# EAGLE design FY - SUPPLY_BOARD (EAGLE 6.1)
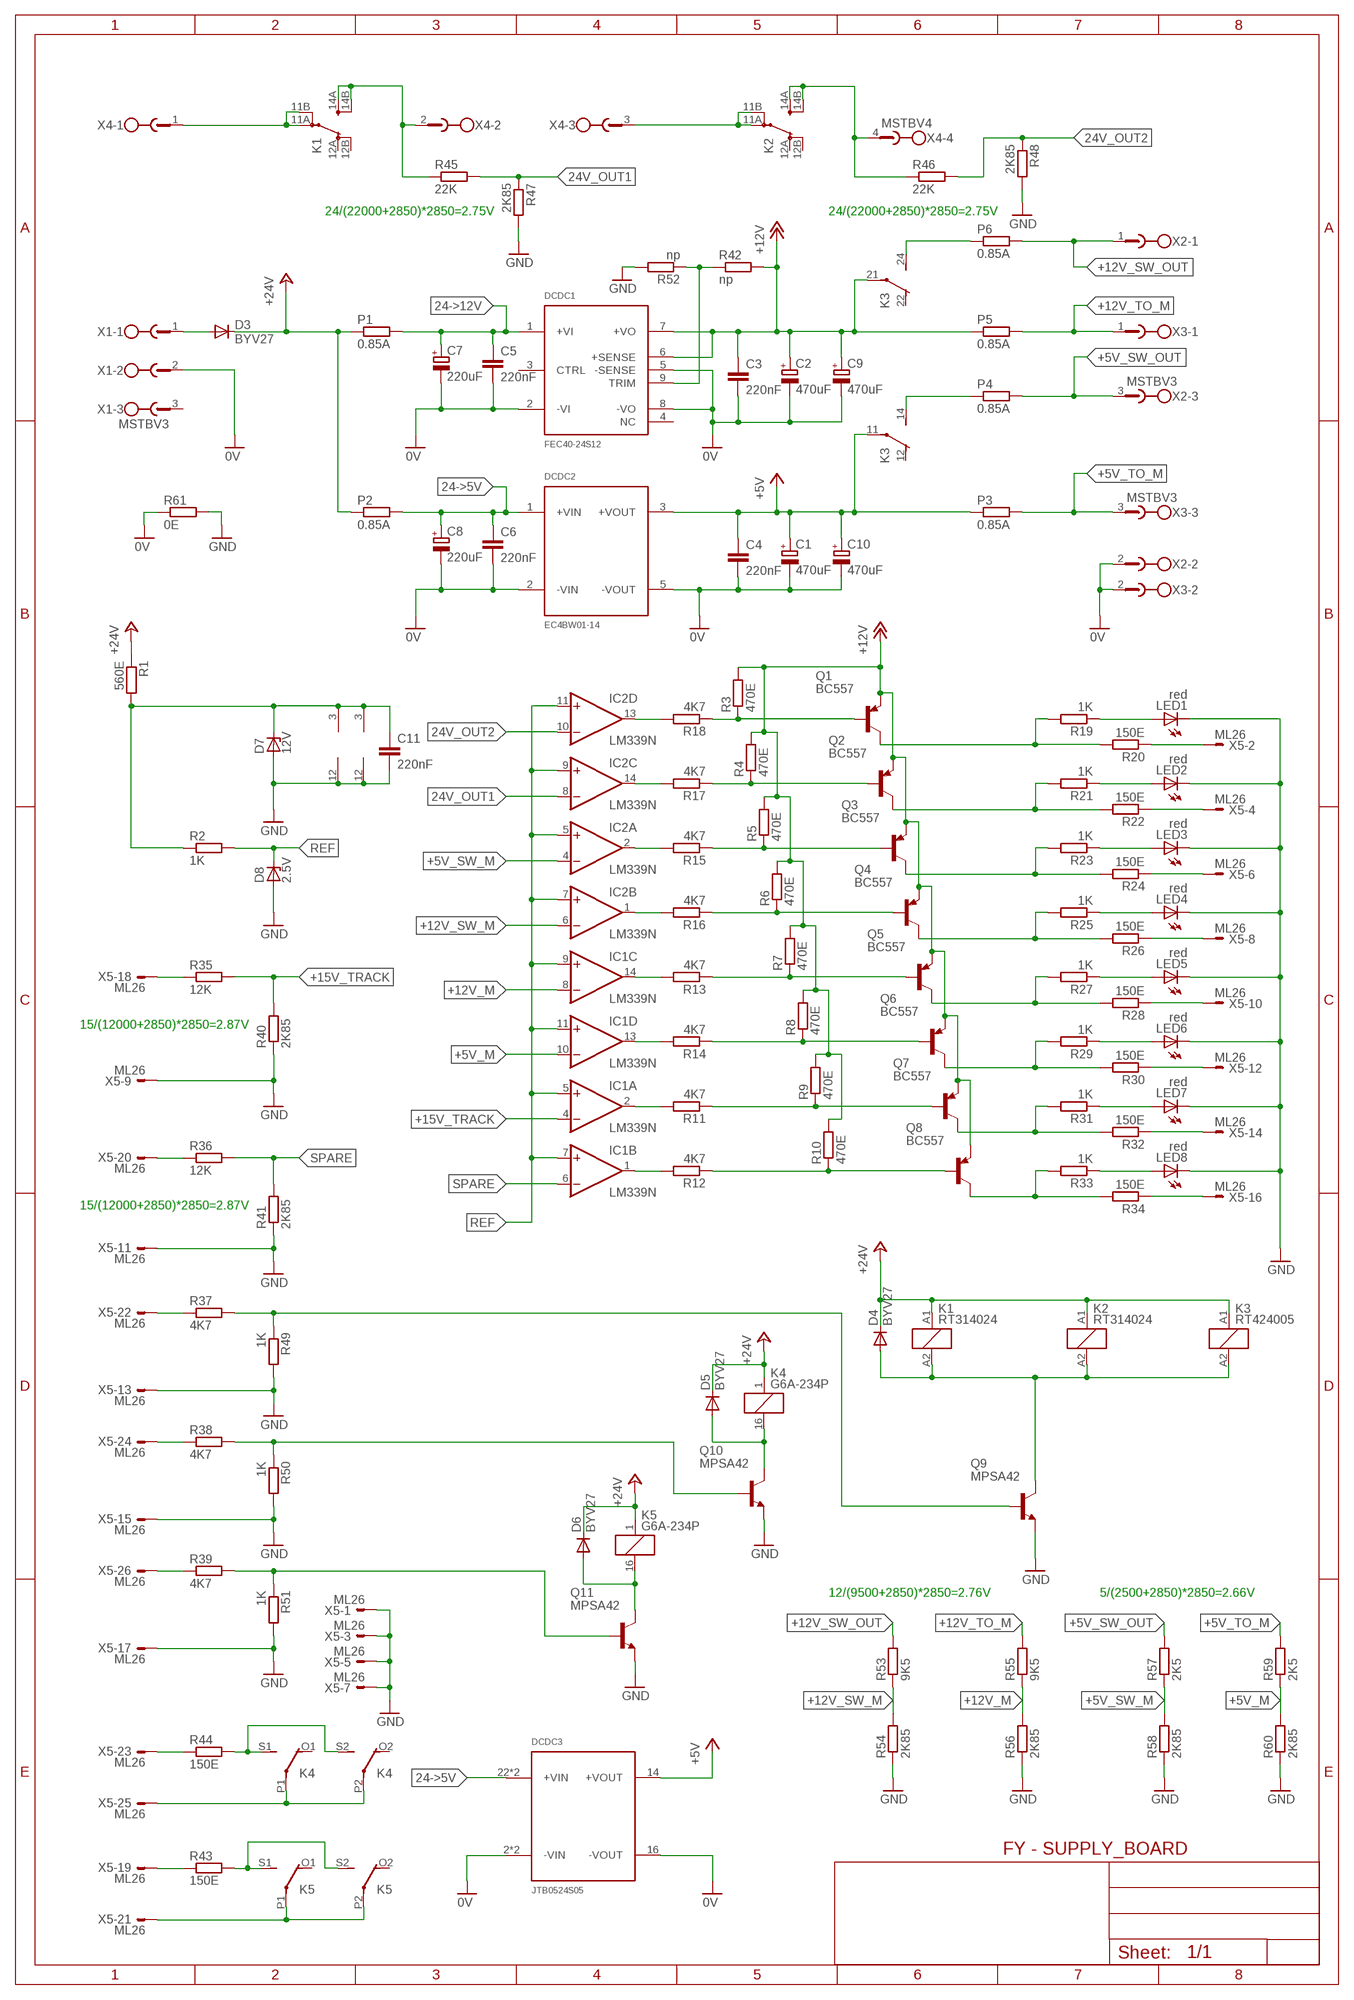
[diagram p0: schematic, sheet 1]

## Parts
C1  470uF  CPOL-EUE5-10.5  [E5-10,5]
C2  470uF  CPOL-EUE5-10.5  [E5-10,5]
C3  220nF  C-EU050-025X075  [C050-025X075]
C4  220nF  C-EU050-025X075  [C050-025X075]
C5  220nF  C-EU050-025X075  [C050-025X075]
C6  220nF  C-EU050-025X075  [C050-025X075]
C7  220uF  CPOL-EUE5-10.5  [E5-10,5]
C8  220uF  CPOL-EUE5-10.5  [E5-10,5]
C9  470uF  CPOL-EUE5-10.5  [E5-10,5]
C10  470uF  CPOL-EUE5-10.5  [E5-10,5]
C11  220nF  C-EU050-025X075  [C050-025X075]
D3  BYV27  [SOD57-10]
D4  BYV27  [SOD57-10]
D5  BYV27  [SOD57-10]
D6  BYV27  [SOD57-10]
D7  12V  ZENER-DIODEZD-7.5  [ZDIO-7.5]
D8  2.5V  ZENER-DIODEZD-7.5  [ZDIO-7.5]
DCDC1  FEC40-24S12  [FEC40-24S12]
DCDC2  EC4BW01-14  [EC4BW01-14]
DCDC3  JTB0524S05  JTB0524S05_JTB0524S05  [XP_POWER_5W]
IC1  LM339N  [DIL14]
IC2  LM339N  [DIL14]
K1  RT314024  [RT-C/O16A5]
K2  RT314024  [RT-C/O16A5]
K3  RT424005  [RT2C/O]
K4  G6A-234P  [G6A-234P]
K5  G6A-234P  [G6A-234P]
LED1  red  LED3MM  [LED3MM]
LED2  red  LED3MM  [LED3MM]
LED3  red  LED3MM  [LED3MM]
LED4  red  LED3MM  [LED3MM]
LED5  red  LED3MM  [LED3MM]
LED6  red  LED3MM  [LED3MM]
LED7  red  LED3MM  [LED3MM]
LED8  red  LED3MM  [LED3MM]
P1  0.85A  R-EU_0207/7  [0207/7]
P2  0.85A  R-EU_0207/7  [0207/7]
P3  0.85A  R-EU_0207/7  [0207/7]
P4  0.85A  R-EU_0207/7  [0207/7]
P5  0.85A  R-EU_0207/7  [0207/7]
P6  0.85A  R-EU_0207/7  [0207/7]
Q1  BC557  [TO92-EBC]
Q2  BC557  [TO92-EBC]
Q3  BC557  [TO92-EBC]
Q4  BC557  [TO92-EBC]
Q5  BC557  [TO92-EBC]
Q6  BC557  [TO92-EBC]
Q7  BC557  [TO92-EBC]
Q8  BC557  [TO92-EBC]
Q9  MPSA42  MPSA42TO92-CBE  [TO92-CBE]
Q10  MPSA42  MPSA42TO92-CBE  [TO92-CBE]
Q11  MPSA42  MPSA42TO92-CBE  [TO92-CBE]
R1  560E  R-EU_0411/15  [0411/15]
R2  1K  R-EU_0207/10  [0207/10]
R3  470E  R-EU_0207/10  [0207/10]
R4  470E  R-EU_0207/10  [0207/10]
R5  470E  R-EU_0207/10  [0207/10]
R6  470E  R-EU_0207/10  [0207/10]
R7  470E  R-EU_0207/10  [0207/10]
R8  470E  R-EU_0207/10  [0207/10]
R9  470E  R-EU_0207/10  [0207/10]
R10  470E  R-EU_0207/10  [0207/10]
R11  4K7  R-EU_0207/10  [0207/10]
R12  4K7  R-EU_0207/10  [0207/10]
R13  4K7  R-EU_0207/10  [0207/10]
R14  4K7  R-EU_0207/10  [0207/10]
R15  4K7  R-EU_0207/10  [0207/10]
R16  4K7  R-EU_0207/10  [0207/10]
R17  4K7  R-EU_0207/10  [0207/10]
R18  4K7  R-EU_0207/10  [0207/10]
R19  1K  R-EU_0207/10  [0207/10]
R20  150E  R-EU_0207/10  [0207/10]
R21  1K  R-EU_0207/10  [0207/10]
R22  150E  R-EU_0207/10  [0207/10]
R23  1K  R-EU_0207/10  [0207/10]
R24  150E  R-EU_0207/10  [0207/10]
R25  1K  R-EU_0207/10  [0207/10]
R26  150E  R-EU_0207/10  [0207/10]
R27  1K  R-EU_0207/10  [0207/10]
R28  150E  R-EU_0207/10  [0207/10]
R29  1K  R-EU_0207/10  [0207/10]
R30  150E  R-EU_0207/10  [0207/10]
R31  1K  R-EU_0207/10  [0207/10]
R32  150E  R-EU_0207/10  [0207/10]
R33  1K  R-EU_0207/10  [0207/10]
R34  150E  R-EU_0207/10  [0207/10]
R35  12K  R-EU_0207/10  [0207/10]
R36  12K  R-EU_0207/10  [0207/10]
R37  4K7  R-EU_0207/10  [0207/10]
R38  4K7  R-EU_0207/10  [0207/10]
R39  4K7  R-EU_0207/10  [0207/10]
R40  2K85  R-EU_0207/10  [0207/10]
R41  2K85  R-EU_0207/10  [0207/10]
R42  np  R-EU_0207/10  [0207/10]
R43  150E  R-EU_0922/11  [0922/11]
R44  150E  R-EU_0922/11  [0922/11]
R45  22K  R-EU_0207/10  [0207/10]
R46  22K  R-EU_0207/10  [0207/10]
R47  2K85  R-EU_0207/10  [0207/10]
R48  2K85  R-EU_0207/10  [0207/10]
R49  1K  R-EU_0207/10  [0207/10]
R50  1K  R-EU_0207/10  [0207/10]
R51  1K  R-EU_0207/10  [0207/10]
R52  np  R-EU_0207/10  [0207/10]
R53  9K5  R-EU_0207/10  [0207/10]
R54  2K85  R-EU_0207/10  [0207/10]
R55  9K5  R-EU_0207/10  [0207/10]
R56  2K85  R-EU_0207/10  [0207/10]
R57  2K5  R-EU_0207/10  [0207/10]
R58  2K85  R-EU_0207/10  [0207/10]
R59  2K5  R-EU_0207/10  [0207/10]
R60  2K85  R-EU_0207/10  [0207/10]
R61  0E  R-EU_0204/2V  [0204V]
X1  MSTBV3  [MSTBV3]
X2  MSTBV3  [MSTBV3]
X3  MSTBV3  [MSTBV3]
X4  MSTBV4  [MSTBV4]
X5  ML26  ML26E  [ML26]

## Nets
0V [RELAY_POWER_24V]: C1.- C2.- C3.2 C4.2 C5.2 C6.2 C7.- C8.- C9.- C10.- DCDC1.2(-VI) DCDC1.5(-SENSE) DCDC1.8(-VO) DCDC2.2(-VIN) DCDC2.5(-VOUT) DCDC3.2(-VIN) DCDC3.3(-VIN) DCDC3.16(-VOUT) R61.1 X1.2 X2.2 X3.2
24->5V [Power]: C6.1 C8.+ DCDC2.1(+VIN) DCDC3.22(+VIN) DCDC3.23(+VIN) P2.2
24->12V [Power]: C5.1 C7.+ DCDC1.1(+VI) P1.2
24V_OUT1: IC2.8(C:-IN) R45.2 R47.1
24V_OUT2: IC2.10(D:-IN) R46.2 R48.1
+5V [RELAY_POWER_24V]: C1.+ C4.1 C10.+ DCDC2.3(+VOUT) DCDC3.14(+VOUT) K3.11(2:P) P3.1
+5V_M: IC1.10(D:-IN) R59.1 R60.2
+5V_SW_M: IC2.4(A:-IN) R57.1 R58.2
+5V_SW_OUT [RELAY_POWER_24V]: P4.2 R57.2 X2.3
+5V_TO_M [RELAY_POWER_24V]: P3.2 R59.2 X3.3
+12V [RELAY_POWER_24V]: C2.+ C3.1 C9.+ DCDC1.6(+SENSE) DCDC1.7(+VO) K3.21(3:P) P5.1 Q1.E Q2.E Q3.E Q4.E Q5.E Q6.E Q7.E Q8.E R3.2 R4.2 R5.2 R6.2 R7.2 R8.2 R9.2 R10.2 R42.2
+12V_M: IC1.8(C:-IN) R55.1 R56.2
+12V_SW_M: IC2.6(B:-IN) R53.1 R54.2
+12V_SW_OUT [RELAY_POWER_24V]: P6.2 R53.2 X2.1
+12V_TO_M [RELAY_POWER_24V]: P5.2 R55.2 X3.1
+15V_TRACK: IC1.4(A:-IN) R35.2 R40.2
+24V [RELAY_POWER_24V]: D3.C D4.C D5.C D6.C K1.A1 K2.A1 K3.A1 K4.1 K5.1 P1.1 P2.1 R1.1
GND [Power]: C11.2 D7.A D8.A IC1.12(P:GND) IC2.12(P:GND) LED1.K(C) LED2.K(C) LED3.K(C) LED4.K(C) LED5.K(C) LED6.K(C) LED7.K(C) LED8.K(C) Q9.E Q10.E Q11.E R40.1 R41.1 R47.2 R48.2 R49.2 R50.2 R51.2 R52.2 R54.1 R56.1 R58.1 R60.1 R61.2 X5.1 X5.3 X5.5 X5.7 X5.9 X5.11 X5.13 X5.15 X5.17
N$1 [RELAY_POWER_24V]: K1.11A(2:PA) K1.11B(2:PB) X4.1
N$2: Q1.B R3.1 R18.1
N$3 [RELAY_POWER_24V]: K2.11A(2:PA) K2.11B(2:PB) X4.3
N$5: R35.1 X5.18
N$7: Q2.B R4.1 R17.1
N$8: Q3.B R5.1 R15.1
N$9 [RELAY_POWER_24V]: K3.24(3:S) P6.1
N$11: DCDC1.9(TRIM) R42.1 R52.1
N$12 [RELAY_POWER_24V]: K3.14(2:S) P4.1
N$14 [Power]: D4.A K1.A2 K2.A2 K3.A2 Q9.C
N$15: C11.1 D7.C IC1.3(P:V+) IC2.3(P:V+) R1.2 R2.1
N$16: Q4.B R6.1 R16.1
N$17: Q5.B R7.1 R13.1
N$18: Q6.B R8.1 R14.1
N$19: Q7.B R9.1 R11.1
N$20: IC1.2(A:OUT) R11.2
N$21: IC1.1(B:OUT) R12.2
N$22: IC1.14(C:OUT) R13.2
N$23: IC1.13(D:OUT) R14.2
N$24: IC2.2(A:OUT) R15.2
N$25: IC2.1(B:OUT) R16.2
N$26: Q1.C R19.2 R20.2
N$27: IC2.14(C:OUT) R17.2
N$28: IC2.13(D:OUT) R18.2
N$29: LED1.A R19.1
N$30: R20.1 X5.2
N$31: Q2.C R21.2 R22.2
N$32: R22.1 X5.4
N$33: Q3.C R23.2 R24.2
N$34: R24.1 X5.6
N$35: Q4.C R25.2 R26.2
N$36: R26.1 X5.8
N$37: Q5.C R27.2 R28.2
N$38: R28.1 X5.10
N$39: Q6.C R29.2 R30.2
N$40: R30.1 X5.12
N$41: Q7.C R31.2 R32.2
N$42: R32.1 X5.14
N$43: Q8.C R33.2 R34.2
N$44: R34.1 X5.16
N$45 [Power]: Q8.B R10.1 R12.1
N$46: LED2.A R21.1
N$47: LED3.A R23.1
N$48: LED4.A R25.1
N$49: LED5.A R27.1
N$50: LED6.A R29.1
N$51: LED7.A R31.1
N$52: LED8.A R33.1
N$53: Q9.B R37.2 R49.1
N$54: Q10.B R38.2 R50.1
N$55: R36.1 X5.20
N$56: Q11.B R39.2 R51.1
N$57: R37.1 X5.22
N$58: K5.S1(2:S) K5.S2(3:S) R43.2
N$59: R38.1 X5.24
N$60: D5.A K4.16 Q10.C
N$61 [Power]: K4.S1(2:S) K4.S2(3:S) R44.2
N$62: R39.1 X5.26
N$63: D6.A K5.16 Q11.C
N$64: R44.1 X5.23
N$65 [RELAY_POWER_24V]: D3.A X1.1
N$66: R43.1 X5.19
N$69 [Power]: K4.P1(2:P) K4.P2(3:P) X5.25
N$70 [Power]: K5.P1(2:P) K5.P2(3:P) X5.21
N$98 [RELAY_POWER_24V]: K2.14A(2:SA) K2.14B(2:SB) R46.1 X4.4
N$99 [RELAY_POWER_24V]: K1.14A(2:SA) K1.14B(2:SB) R45.1 X4.2
REF: D8.C IC1.5(A:+IN) IC1.7(B:+IN) IC1.9(C:+IN) IC1.11(D:+IN) IC2.5(A:+IN) IC2.7(B:+IN) IC2.9(C:+IN) IC2.11(D:+IN) R2.2
SPARE: IC1.6(B:-IN) R36.2 R41.2
Unconnected: DCDC1.3(CTRL) DCDC1.4(NC) K1.12A(2:OA) K1.12B(2:OB) K2.12A(2:OA) K2.12B(2:OB) K3.12(2:O) K3.22(3:O) K4.O1(2:O) K4.O2(3:O) K5.O1(2:O) K5.O2(3:O) X1.3

## Notes on the sheet
- 24/(22000+2850)*2850=2.75V | 24/(22000+2850)*2850=2.75V
- 15/(12000+2850)*2850=2.87V
- 15/(12000+2850)*2850=2.87V
- 12/(9500+2850)*2850=2.76V | 5/(2500+2850)*2850=2.66V

## Library data of the parts
C1 C2 C7-C10 = rcl:CPOL-EU: POLARIZED CAPACITOR, European symbol
C3-C6 C11 = rcl:C-EU: CAPACITOR, European symbol
D3-D6 = diode:BYV27: DIODE ultra fast
D7 D8 = diode:ZENER-DIODE: Z-Diode
DCDC1 = JSIF-DCDC:FEC40-24S12: Power Mate Technology Input 18-36V Output 12VDC 3333mA
DCDC2 = JSIF-DCDC:EC4BW01-14: CINCON EC4BW01-14 DCDC converter 10-33VDC input, 5VDC 2000mA Output
DCDC3 = JSIF-DCDC:JTB0524S05: XP Power DCDC converter JTB0524S05 Input 9-36 VDC Output 5VDC 1.0A
IC1 IC2 = linear:LM339: Low Power Low Offset Voltage Quad Comparators with open collector; LM139/LM239/LM339/LM2901/LM3302
K1 K2 = relay:RT31*: Power PCB Relayl SCHRACK 1 pole 12 / 16 A, DC- or AC-coi Source: http://www.schrack.com/.. 5819.pdf; MF: TYCO ELECTRONICS; MPN: RT314024; OC_FARNELL: 1629045; OC_NEWARK: 36K2037
K3 = relay:RT42?*: Power PCB Relay SCHRACK 2 pole 8 A, DC and AC-coil Source: http://www.schrack.com/.. 5842.pdf; MPN: RT424005; OC_FARNELL: 1629052; OC_NEWARK: 03P2425
K4 K5 = relay:G6A-234P: RELAY 2 x switch, 0.3 A/125 V AC, 1 A/30 V DC, Omron; OC_FARNELL: unknown; OC_NEWARK: unknown
LED1-LED8 = led:LED: LED OSRAM: - CHIPLED LG R971, LG N971, LY N971, LG Q971, LY Q971, LO R971, LY R971 LH N974, LH R974 LS Q976, LO Q976, LY Q976 LO Q996 - Hyper CHIPLED LW Q18S LB Q993, LB Q99A, LB R99A - SideLED LS A670, LO A670, LY A670, LG A670, LP A670 LB A673, LV A673, LT A673, LW A673 LH A674 LY A675 LS A676, LA A676, LO A676, LY A676, LW A676 LS A679, LY A679, LG A679 - Hyper Micro SIDELED® LS Y876, LA Y876, LO Y876, LY Y876 LT Y87S - SmartLED LW L88C, LW L88S LB L89C, LB L89S, LG L890 LS L89K, LO L89K, LY L89K LS L896, LA L896, LO L896, LY L896 - TOPLED LS T670, LO T670, LY T670, LG T670, LP T670 LSG T670, LSP T670, LSY T670, LOP T670, LYG T670 LG T671, LOG T671, LSG T671 LB T673, LV T673, LT T673, LW T673 LH T674 LS T676, LA T676, LO T676, LY T676, LB T676, LH T676, LSB T676, LW T676 LB T67C, LV T67C, LT T67C, LS T67K, LO T67K, LY T67K, LW E67C LS E67B, LA E67B, LO E67B, LY E67B, LB E67C, LV E67C, LT E67C LW T67C LS T679, LY T679, LG T679 LS T770, LO T770, LY T770, LG T770, LP T770 LB T773, LV T773, LT T773, LW T773 LH T774 LS E675, LA E675, LY E675, LS T675 LS T776, LA T776, LO T776, LY T776, LB T776 LHGB T686 LT T68C, LB T68C - Hyper Mini TOPLED® LB M676 - Mini TOPLED Santana® LG M470 LS M47K, LO M47K, LY M47K Source: http://www.osram.convergy.de LUXEON: - LUMILED® LXK2-PW12-R00, LXK2-PW12-S00, LXK2-PW14-U00, LXK2-PW14-V00 LXK2-PM12-R00, LXK2-PM12-S00, LXK2-PM14-U00 LXK2-PE12-Q00, LXK2-PE12-R00, LXK2-PE12-S00, LXK2-PE14-T00, LXK2-PE14-U00 LXK2-PB12-K00, LXK2-PB12-L00, LXK2-PB12-M00, LXK2-PB14-N00, LXK2-PB14-P00, LXK2-PB14-Q00 LXK2-PR12-L00, LXK2-PR12-M00, LXK2-PR14-Q00, LXK2-PR14-R00 LXK2-PD12-Q00, LXK2-PD12-R00, LXK2-PD12-S00 LXK2-PH12-R00, LXK2-PH12-S00 LXK2-PL12-P00, LXK2-PL12-Q00, LXK2-PL12-R00 Source: www.luxeon.com KINGBRIGHT: KA-3528ASYC Source: www.kingbright.com
P1-P6 R1-R42 R45-R60 = rcl:R-EU_: RESISTOR, European symbol
Q1-Q8 = transistor-pnp:BC557*: PNP Transistror
Q9-Q11 = transistor-npn:MPSA42: MPSA42 300V 500mA
R43 R44 R61 = resistor:R-EU_: RESISTOR, European symbol
X1-X3 = con-phoenix-508:MSTBV3: PHOENIX; MPN: MSTBV 2,5/3-GF-5.08; OC_FARNELL: 1792793; OC_NEWARK: 69R9846
X4 = con-phoenix-508:MSTBV4: PHOENIX; MPN: MSTBV 2,5/4-GF-5.08; OC_FARNELL: 1792794; OC_NEWARK: 69R9847
X5 = con-harting-ml:ML26?E: HARTING; OC_FARNELL: unknown; OC_NEWARK: unknown

## Net classes
0 default: width 0.305 mm, clearance 0.305 mm
1 Power: width 0.61 mm, clearance 0.305 mm
2 RELAY_POWER_24V: width 1.422 mm, clearance 0.61 mm

## Board
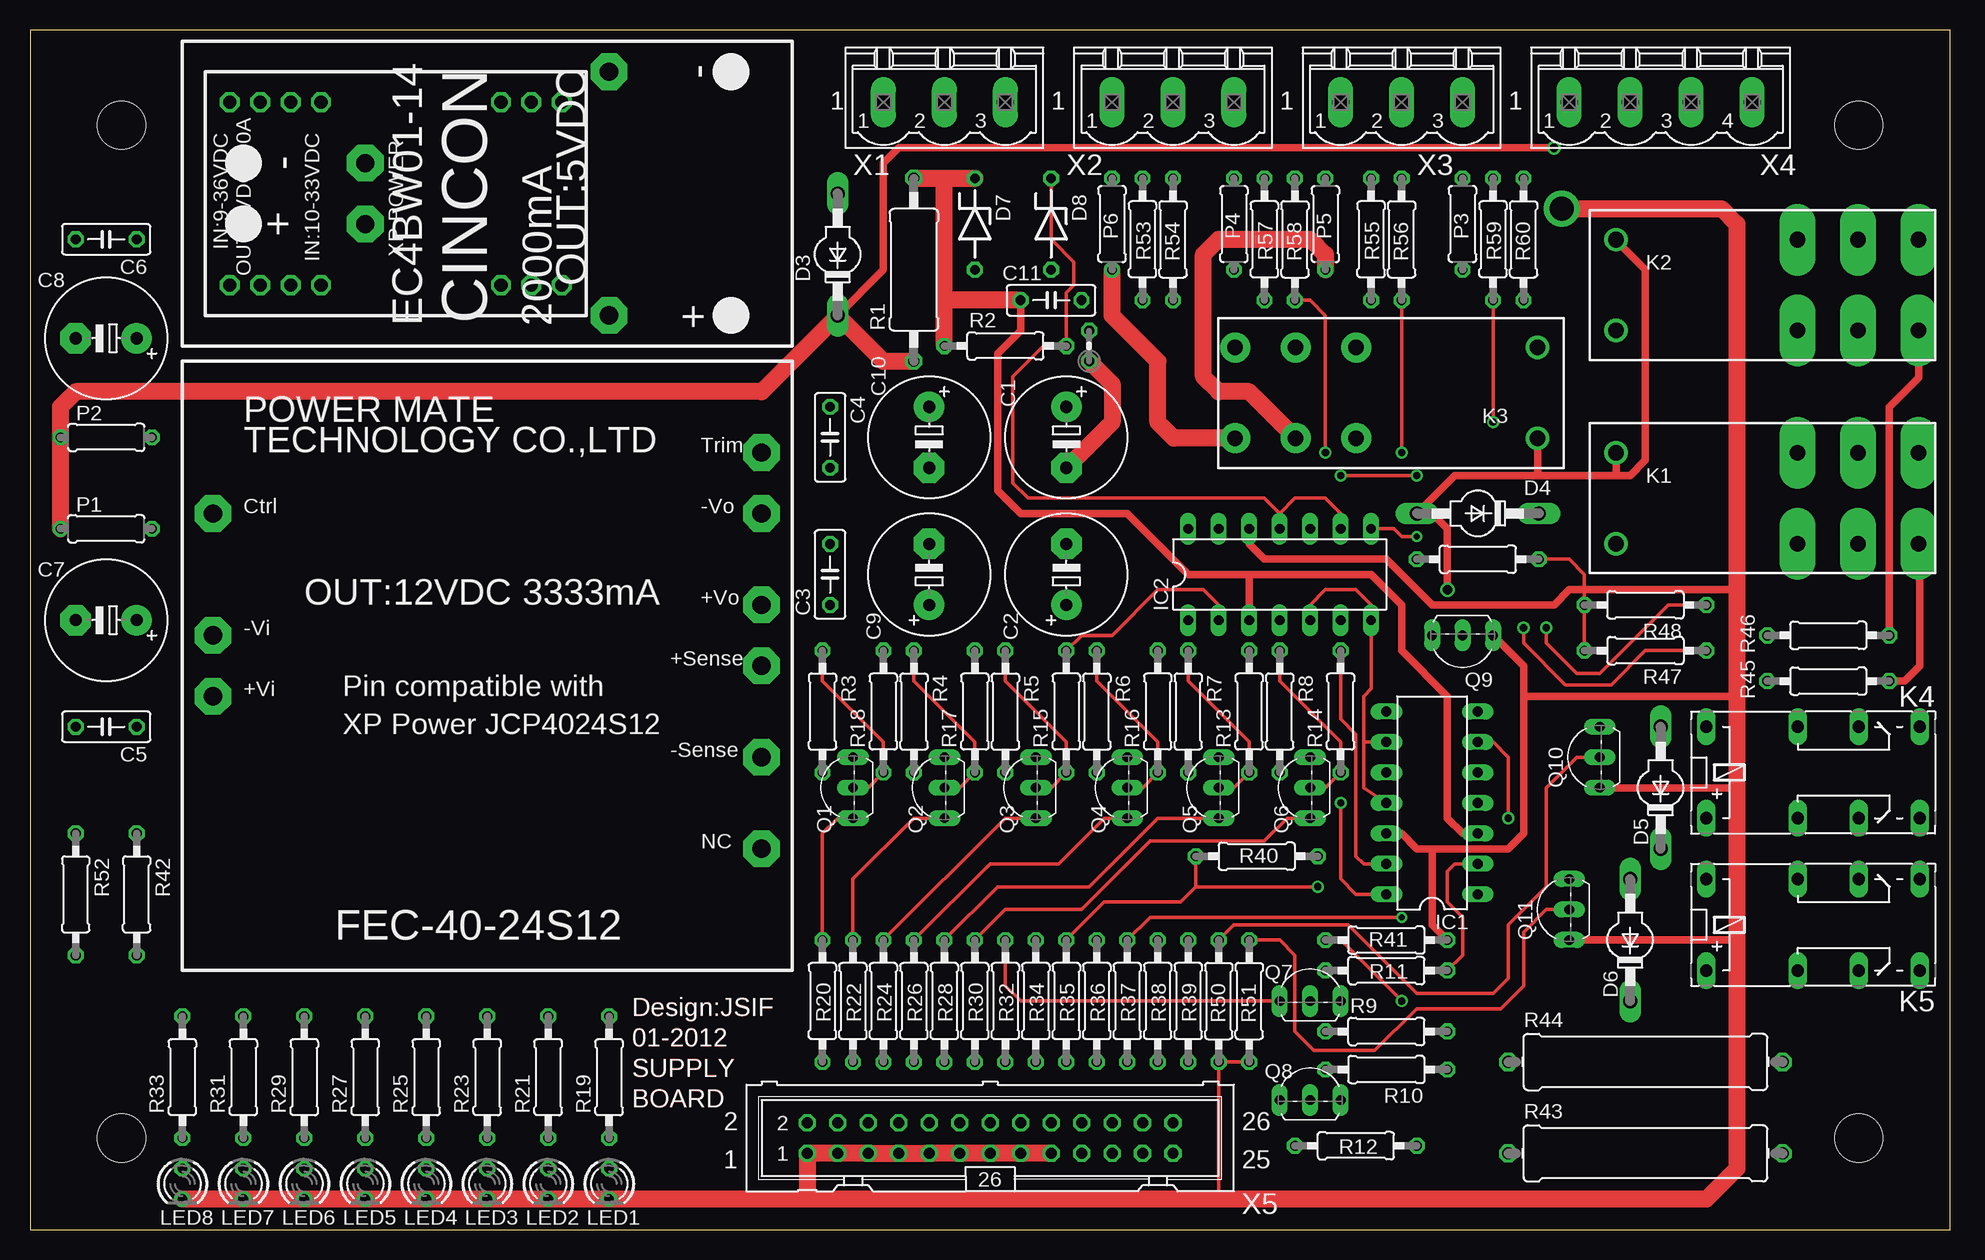
[diagram p1: board, top side]
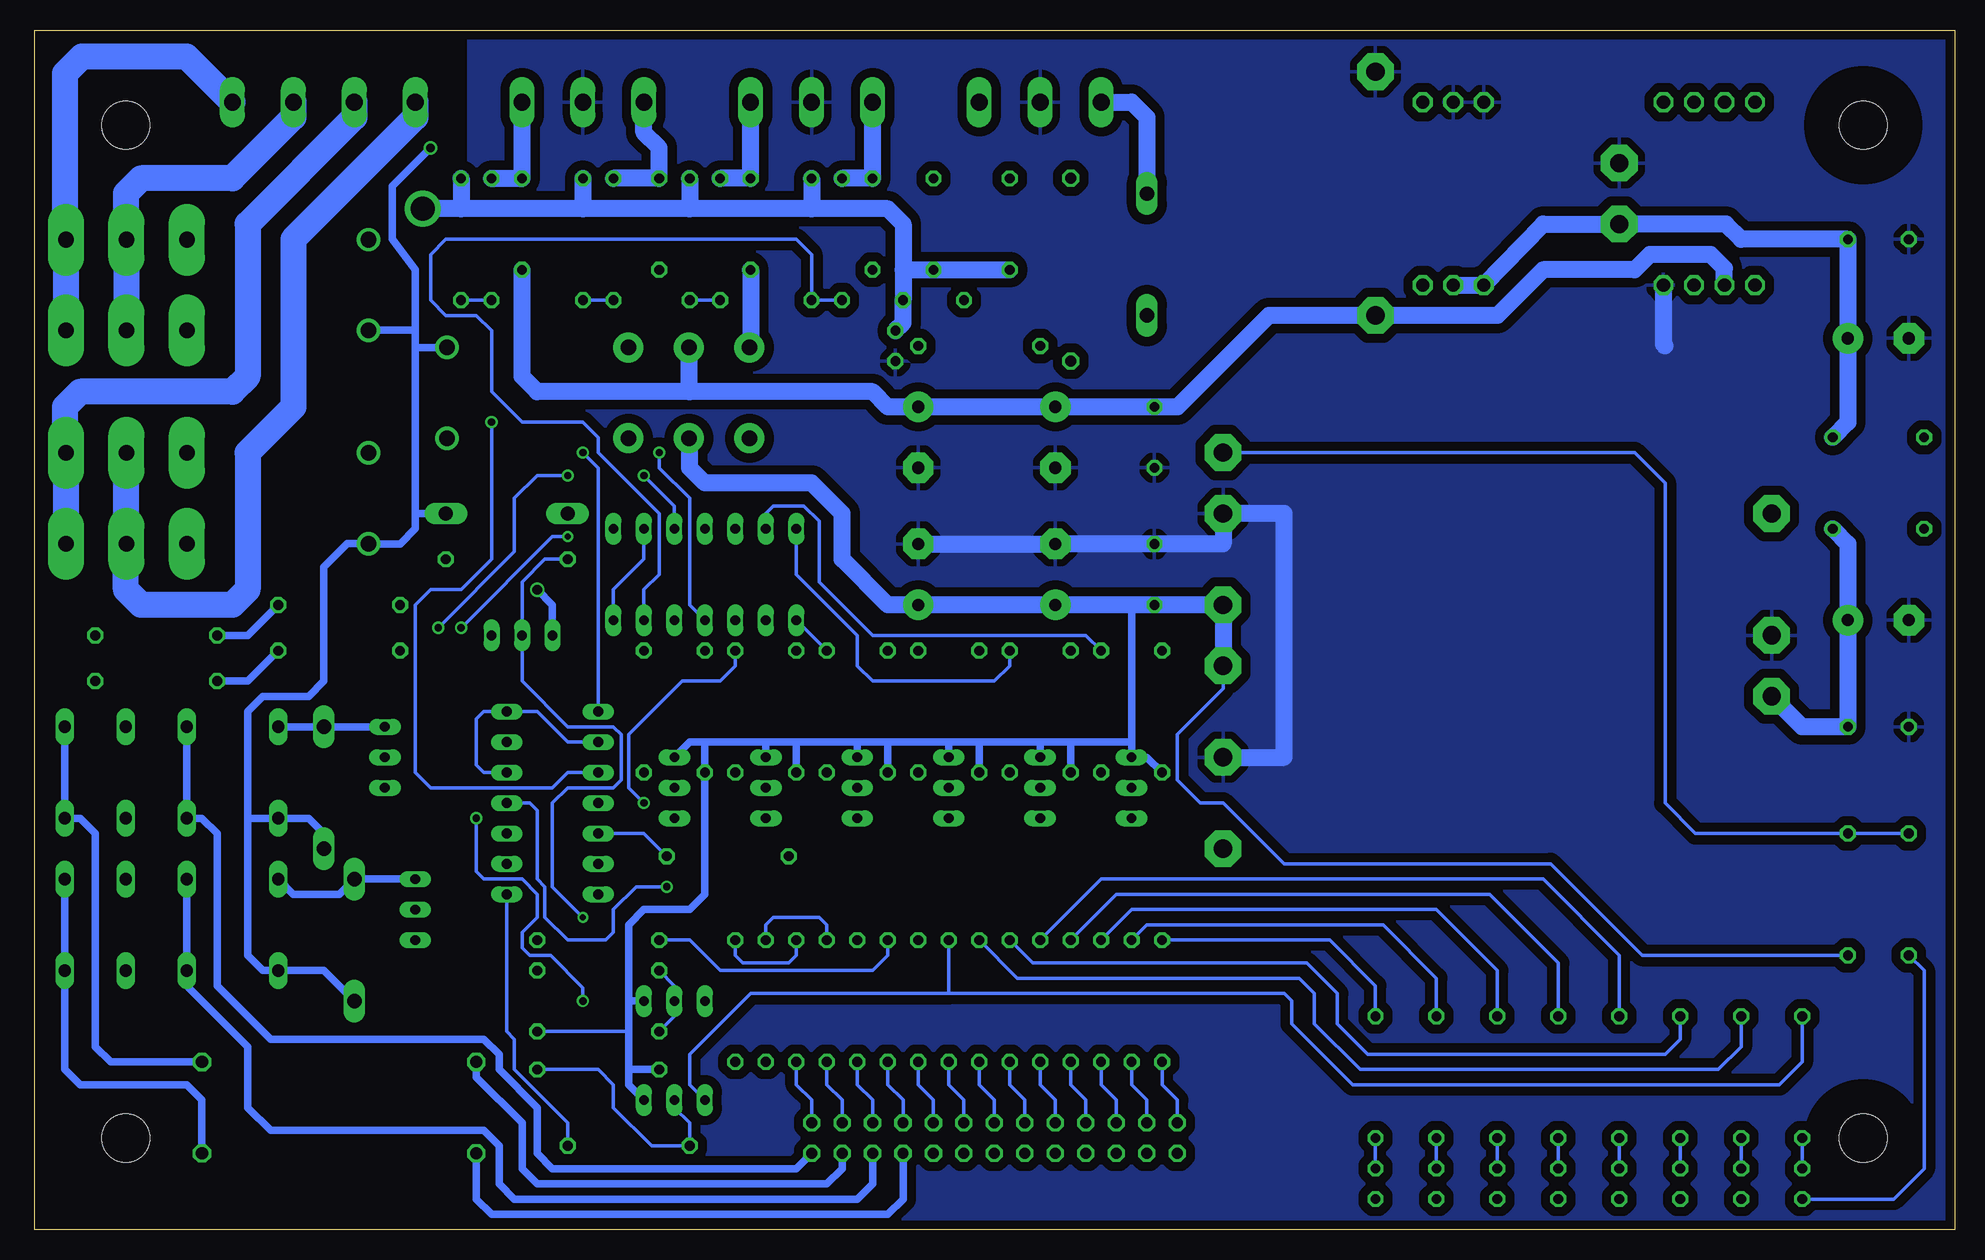
[diagram p2: board, bottom side, seen from below]

Size 160 x 100 mm. Coordinates in mm from the lower left corner, seen from the top.
Outline: 0,0 160,0 160,100 0,100 0,0
Copper layers (1*16): Top 0.035mm / dielectric 1.5mm / Bottom 0.035mm
Design rules: minimum track width 12mil, minimum drill 12mil, track to track 8mil, track to pad 8mil, pad to pad 8mil, via to via 8mil, smd to smd 8mil, copper to edge 30mil, drill to drill 8mil, minimum pad ring 10mil, minimum via ring 8mil, stop-mask expansion 4mil, vias tented up to drill 0mil, thermal gap 24mil
Holes 4 mm at 7.62,92.08 7.62,7.62 152.4,7.62 152.4,92.08
bRestrict: area 3.6,3.6 to 11.6,11.6; area 3.6,88.1 to 11.6,96.1

### Footprints (pad centres in the part's own frame; a part is rotated, then mirrored left to right if it is on the bottom)
E5-10,5 = drill 1.016 pad 2.54: + -2.54,0 | drill 1.016 pad 2.54 octagon: - 2.54,0
C050-025X075 = drill 0.813 octagon: 1 -2.54,0; 2 2.54,0
SOD57-10 = drill 1.194 long: A 5.08,0; C -5.08,0
ZDIO-7.5 = drill 0.813 octagon: A 3.81,0; C -3.81,0
FEC40-24S12 = drill 1.524 pad 3.048 octagon: 1 -22.86,-2.54; 2 -22.86,2.54; 3 -22.86,12.7; 4 22.86,-15.24; 5 22.86,-7.62; 6 22.86,0; 7 22.86,5.08; 8 22.86,12.7; 9 22.86,17.78
EC4BW01-14 = drill 1.524 pad 3.048 octagon: 1 2.54,-10.16; 2 -2.54,-10.16; 3 10.16,10.16; 5 -10.16,10.16
XP_POWER_5W = drill 1.1 octagon: 1 -7.62,13.843; 2 -7.62,11.303; 3 -7.62,8.763; 9 -7.62,-6.223; 10 -7.62,-8.763; 11 -7.62,-11.303; 12 -7.62,-13.843; 13 7.62,-13.843; 14 7.62,-11.303; 15 7.62,-8.763; 16 7.62,-6.223; 22 7.62,8.763; 23 7.62,11.303; 24 7.62,13.843
DIL14 = drill 0.813 long: 1 -7.62,-3.81; 2 -5.08,-3.81; 3 -2.54,-3.81; 4 0,-3.81; 5 2.54,-3.81; 6 5.08,-3.81; 7 7.62,-3.81; 8 7.62,3.81; 9 5.08,3.81; 10 2.54,3.81; 11 0,3.81; 12 -2.54,3.81; 13 -5.08,3.81; 14 -7.62,3.81
RT-C/O16A5 = drill 1.3 pad 3 long: 11A 7.56,3.78; 11B 7.56,-3.78; 12A 2.52,3.78; 12B 2.52,-3.78; 14A 12.6,3.78; 14B 12.6,-3.78 | drill 1.3: A1 -12.6,-3.78; A2 -12.6,3.78
RT2C/O = drill 1.3 pad 2.5: 11 7.56,-3.68; 12 2.52,-3.68; 14 12.6,-3.68; 21 7.56,3.88; 22 2.52,3.88; 24 12.6,3.88 | drill 1.3: A1 -12.6,-3.68; A2 -12.6,3.88
G6A-234P = drill 1.016 long: 1 -3.81,-3.81; 16 -3.81,3.81; O1 8.89,-3.81; O2 8.89,3.81; P1 3.81,-3.81; P2 3.81,3.81; S1 13.97,-3.81; S2 13.97,3.81
LED3MM = drill 0.813 octagon: A -1.27,0; K 1.27,0
0207/7 = drill 0.813 octagon: 1 -3.81,0; 2 3.81,0
TO92-EBC = drill 0.813 long: B 0,-1.27; C -2.54,-1.27; E 2.54,-1.27
TO92-CBE = drill 0.813 long: B 0,0; C 2.54,0; E -2.54,0
0411/15 = drill 0.914 octagon: 1 -7.62,0; 2 7.62,0
0207/10 = drill 0.813 octagon: 1 -5.08,0; 2 5.08,0
0922/11 = drill 1.016 octagon: 1 -11.43,0; 2 11.43,0
0204V = drill 0.813 octagon: 1 -1.27,0; 2 1.27,0
MSTBV3 = drill 1.397 long: 1 -5.08,0; 2 0,0; 3 5.08,0
MSTBV4 = drill 1.397 long: 1 -7.62,0; 2 -2.54,0; 3 2.54,0; 4 7.62,0
ML26 = drill 0.914 octagon: 1 -15.24,-1.27; 2 -15.24,1.27; 3 -12.7,-1.27; 4 -12.7,1.27; 5 -10.16,-1.27; 6 -10.16,1.27; 7 -7.62,-1.27; 8 -7.62,1.27; 9 -5.08,-1.27; 10 -5.08,1.27; 11 -2.54,-1.27; 12 -2.54,1.27; 13 0,-1.27; 14 0,1.27; 15 2.54,-1.27; 16 2.54,1.27; 17 5.08,-1.27; 18 5.08,1.27; 19 7.62,-1.27; 20 7.62,1.27; 21 10.16,-1.27; 22 10.16,1.27; 23 12.7,-1.27; 24 12.7,1.27; 25 15.24,-1.27; 26 15.24,1.27

### Placement (x,y rotation side)
C1  86.36,66.04 270 top
C2  86.36,54.61 90 top
C3  66.67,54.61 90 top
C4  66.67,66.04 270 top
C5  6.35,41.91 180 top
C6  6.35,82.55 180 top
C7  6.35,50.8 180 top
C8  6.35,74.3 180 top
C9  74.93,54.61 90 top
C10  74.93,66.04 270 top
C11  85.09,77.47 0 top
D3  67.31,81.28 90 top
D4  120.65,59.69 180 top
D5  135.89,36.83 90 top
D6  133.35,24.13 90 top
D7  78.74,83.82 270 top
D8  85.09,83.82 270 top
DCDC1  38.1,46.99 0 top
DCDC2  38.1,86.36 270 top
DCDC3  30.48,86.36 270 top
IC1  116.84,35.56 90 top
IC2  104.14,54.61 0 top
K1  144.78,60.96 0 top
K2  144.78,78.74 0 top
K3  113.03,69.85 180 top
K4  143.51,38.1 0 top
K5  143.51,25.4 0 top
LED1  48.26,3.81 270 top
LED2  43.18,3.81 270 top
LED3  38.1,3.81 270 top
LED4  33.02,3.81 270 top
LED5  27.94,3.81 270 top
LED6  22.86,3.81 270 top
LED7  17.78,3.81 270 top
LED8  12.7,3.81 270 top
P1  6.35,58.42 0 top
P2  6.35,66.04 0 top
P3  119.38,83.82 90 top
P4  100.33,83.82 90 top
P5  107.95,83.82 90 top
P6  90.17,83.82 90 top
Q1  67.31,36.83 90 top
Q2  74.93,36.83 90 top
Q3  82.55,36.83 90 top
Q4  90.17,36.83 90 top
Q5  97.79,36.83 90 top
Q6  105.41,36.83 90 top
Q7  106.68,20.32 0 top
Q8  106.68,12.06 0 top
Q9  119.38,49.53 180 top
Q10  130.81,39.37 90 top
Q11  128.27,26.67 90 top
R1  73.66,80.01 90 top
R2  81.28,73.66 0 top
R3  66.04,43.18 270 top
R4  73.66,43.18 270 top
R5  81.28,43.18 270 top
R6  88.9,43.18 270 top
R7  96.52,43.18 270 top
R8  104.14,43.18 270 top
R9  113.03,16.51 0 top
R10  113.03,13.34 180 top
R11  113.03,21.59 0 top
R12  110.49,6.99 0 top
R13  101.6,43.18 90 top
R14  109.22,43.18 90 top
R15  86.36,43.18 90 top
R16  93.98,43.18 90 top
R17  78.74,43.18 90 top
R18  71.12,43.18 90 top
R19  48.26,12.7 90 top
R20  66.04,19.05 90 top
R21  43.18,12.7 90 top
R22  68.58,19.05 90 top
R23  38.1,12.7 90 top
R24  71.12,19.05 90 top
R25  33.02,12.7 90 top
R26  73.66,19.05 90 top
R27  27.94,12.7 90 top
R28  76.2,19.05 90 top
R29  22.86,12.7 90 top
R30  78.74,19.05 90 top
R31  17.78,12.7 90 top
R32  81.28,19.05 90 top
R33  12.7,12.7 90 top
R34  83.82,19.05 90 top
R35  86.36,19.05 90 top
R36  88.9,19.05 90 top
R37  91.44,19.05 90 top
R38  93.98,19.05 90 top
R39  96.52,19.05 90 top
R40  102.23,31.11 180 top
R41  113.03,24.13 180 top
R42  8.89,27.94 270 top
R43  134.62,6.35 0 top
R44  134.62,13.97 0 top
R45  149.86,45.72 180 top
R46  149.86,49.53 180 top
R47  134.62,48.26 180 top
R48  134.62,52.07 180 top
R49  120.65,55.88 0 top
R50  99.06,19.05 270 top
R51  101.6,19.05 270 top
R52  3.81,27.94 270 top
R53  92.71,82.55 90 top
R54  95.25,82.55 270 top
R55  111.76,82.55 90 top
R56  114.3,82.55 270 top
R57  102.87,82.55 90 top
R58  105.41,82.55 270 top
R59  121.92,82.55 90 top
R60  124.46,82.55 270 top
R61  88.27,73.66 90 top
X1  76.2,93.98 0 top
X2  95.25,93.98 0 top
X3  114.3,93.98 0 top
X4  135.89,93.98 0 top
X5  80.01,7.62 0 top

### Tracks (layer width: path | path; a pad name or v marks a point on that pad's centre or on a via)
0V
  Top 1.422: R61.1 90.17,70.48 90.17,67.31 C1.-
  Bottom 1.422: DCDC1.5 55.88,39.37 55.88,59.69 DCDC1.8 60.96,57.15 C3.2 C9.- C2.- | DCDC3.16 24.26,73.79 24.13,73.66
  pour Bottom (isolate 0.762): 0.64,99.69 123.83,99.69 123.83,0.64 0.64,0.64
24->5V
  Bottom 1.422: DCDC3.23 DCDC3.22 34.29,83.82 DCDC2.1 19.05,83.82 17.78,82.55 C6.1 C8.+ 8.89,67.31 P2.2
24->12V
  Bottom 1.422: P1.2 8.89,57.15 C7.+ C5.1 12.7,41.91 DCDC1.1
24V_OUT1  (via drill 0.5, 0.6)
  Top 0.305: R47.1 134.62,48.26 131.76,45.4 127.95,45.4 124.46,48.9 v124.46,50.16 | v115.57,57.78 114.3,57.78 113.67,58.42 IC2.8
  Bottom 0.305: v124.46,50.16 116.84,57.78 v115.57,57.78
  Bottom 0.61: R47.1 142.24,45.72 R45.2
24V_OUT2  (via drill 0.6)
  Top 0.305: R48.1 136.53,52.07 130.81,46.35 128.91,46.35 126.36,48.9 v126.36,50.16 | v109.22,62.87 v115.57,62.87
  Bottom 0.305: v126.36,50.16 120.02,56.52 120.02,60.96 118.11,62.87 v115.57,62.87 | IC2.10 106.68,60.33 v109.22,62.87
  Bottom 0.61: R46.2 142.24,49.53 R48.1
+5V
  Bottom 1.422: P3.1 119.38,71.12 118.11,69.85 105.41,69.85 | DCDC3.14 19.18,80.14 20.32,81.28 25.4,81.28 26.67,80.01 34.29,80.01 38.1,76.2 DCDC2.3 57.15,76.2 64.77,68.58 C4.1 C10.+ C1.+ 88.9,68.58 90.17,69.85 105.41,69.85 | K3.11 105.47,69.91 105.41,69.85
+5V_M  (via drill 0.6)
  Top 0.305: R59.1 v121.92,67.31
  Bottom 0.305: R60.2 R59.1 | v121.92,67.31 121.92,55.88 124.46,53.34 127,53.34 128.27,52.07 128.27,38.1 127,36.83 116.84,36.83 115.57,38.1 IC1.10
+5V_SW_M  (via drill 0.6)
  Top 0.305: R58.2 106.68,77.47 107.95,76.2 v107.95,64.77
  Bottom 0.305: R57.1 R58.2 | v107.95,64.77 107.95,63.5 105.41,60.96 105.41,52.07 IC2.4
+5V_SW_OUT
  Bottom 1.422: X2.3 P4.2 R57.2
+5V_TO_M
  Bottom 1.422: X3.3 P3.2 R59.2
+12V
  Top 1.422: P5.1 107.95,81.28 106.68,82.55 99.06,82.55 97.79,81.28 97.79,71.12 99.06,69.85 101.6,69.85 K3.21
  Bottom 0.305: R9.2 110.49,16.51 | R42.2 26.04,22.86 33.66,30.48 55.88,30.48 60.96,35.56 62.87,35.56 64.77,37.47 64.77,41.27 60.96,45.09 DCDC1.6
  Bottom 0.61: 68.58,40.64 Q1.E 67.31,39.37 R3.2 | 68.58,40.64 73.66,40.64 | 73.66,40.64 76.2,40.64 | R4.2 73.66,40.64 | Q2.E 76.2,40.64 | 76.2,40.64 81.28,40.64 | 81.28,40.64 R5.2 | Q3.E 83.82,40.64 | 83.82,40.64 81.28,40.64 | 88.9,40.64 83.82,40.64 | R6.2 88.9,40.64 | 88.9,40.64 91.44,40.64 | Q4.E 91.44,40.64 | 91.44,40.64 96.52,40.64 | R7.2 96.52,40.64 | 96.52,40.64 99.06,40.64 | Q5.E 99.06,40.64 | 99.06,40.64 104.14,40.64 | 104.14,40.64 R8.2 104.14,27.94 105.41,26.67 109.22,26.67 110.49,25.4 110.49,19.05 | 104.14,40.64 105.41,40.64 Q6.E | 110.49,19.05 110.49,16.51 110.49,13.34 | 110.49,13.34 110.49,12.06 Q8.E | Q7.E 110.49,19.05 | R10.2 110.49,13.34 | 68.58,40.64 68.58,52.07
  Bottom 1.422: DCDC1.6 DCDC1.7 C3.1 68.58,52.07 C9.+ C2.+ 88.9,52.07 92.71,55.88 92.71,59.69 95.25,62.23 104.14,62.23 105.41,63.5 105.41,65.91 K3.21
+12V_M  (via drill 0.6)
  Top 0.305: R56.2 v114.3,64.77
  Bottom 0.305: R55.1 R56.2 | v114.3,64.77 113.03,63.5 IC1.8
+12V_SW_M
  Bottom 0.305: R53.1 R54.2 95.25,81.28 96.52,82.55 125.73,82.55 127,81.28 127,77.47 125.73,76.2 123.19,76.2 121.92,74.93 121.92,69.85 119.38,67.31 114.3,67.31 113.03,66.04 113.03,64.77 107.95,59.69 107.95,54.61 109.22,53.34 IC2.6
+12V_SW_OUT
  Bottom 1.422: X2.1 P6.2 R53.2
+12V_TO_M
  Bottom 1.422: X3.1 109.22,91.44 107.95,90.17 P5.2 R55.2
+15V_TRACK  (via drill 0.6)
  Top 0.305: v107.31,28.57 97.16,28.57 | 97.16,28.57 95.89,27.3 89.53,27.3 R35.2 | R40.2 97.16,28.57
  Bottom 0.305: IC1.4 118.75,35.56 118.11,34.92 118.11,29.21 117.47,28.57 117.47,26.04 115.57,24.13 112.39,24.13 111.76,24.77 111.76,26.67 109.86,28.57 v107.31,28.57
+24V  (via drill 0.7)
  Top 0.61: v127,90.17 72.39,90.17 71.12,88.9 71.12,80.01 D3.C
  Top 1.422: P1.1 P2.1 2.54,68.58 3.81,69.85 60.96,69.85 D3.C 71.12,72.39 R1.1
  Bottom 0.61: v127,90.17 130.18,87 130.18,82.55 128.27,80.01 128.27,74.93 | 128.27,74.93 128.27,73.66 | 128.27,73.66 128.27,59.69 | 128.27,59.69 128.27,58.42 129.54,57.15 132.15,57.15 K1.A1 133.96,57.18 135.89,55.24 135.89,45.72 137.16,44.45 140.97,44.45 142.24,43.18 142.24,34.29 | K3.A1 128.14,73.53 128.27,73.66 | K2.A1 128.3,74.96 128.27,74.93 | D4.C 128.27,59.69 | 142.24,34.29 142.24,22.86 140.97,21.59 K5.1 135.89,21.59 D6.C | D5.C 135.89,33.02 137.16,34.29 K4.1 142.24,34.29
GND  (via drill 2)
  Top 0.305: R47.2 R48.2 129.54,53.34 129.54,54.61 128.27,55.88 R49.2 | R51.2 R50.2 99.06,2.54
  Top 0.61: Q10.E 142.24,36.83 | Q11.E 142.24,24.13 | 124.46,44.45 142.24,44.45 | IC2.12 101.6,57.15 102.87,55.88 113.03,55.88 116.84,52.07 127,52.07 128.27,53.34 129.54,53.34 142.24,53.34 | IC1.12 114.3,33.02 115.57,31.75 116.84,31.75 | 116.84,31.75 123.19,31.75 124.46,33.02 124.46,44.45 | R41.1 116.84,25.4 116.84,31.75 | 124.46,44.45 124.46,46.99 Q9.E
  Top 1.422: 64.77,2.54 99.06,2.54 139.7,2.54 142.24,5.08 142.24,24.13 142.24,36.83 142.24,44.45 142.24,53.34 142.24,83.82 140.97,85.09 v127.64,85.09 | 64.77,2.54 LED1.K LED2.K LED3.K LED4.K LED5.K LED6.K LED7.K LED8.K | 64.77,2.54 X5.1 X5.3 X5.5 X5.7 X5.9 X5.11 X5.13 X5.15 X5.17
  Bottom 0.305: IC1.12 109.22,33.02 R40.1 | R52.2 2.54,21.59 2.54,5.08 5.08,2.54 LED8.K
  Bottom 1.422: D7.A D8.A 87.63,80.01 | 95.25,85.09 88.9,85.09 87.63,83.82 87.63,80.01 | 95.25,85.09 105.41,85.09 | 105.41,85.09 114.3,85.09 | 114.3,85.09 124.46,85.09 | 124.46,85.09 v127.64,85.09 | R56.1 114.3,85.09 | R58.1 105.41,85.09 | R54.1 95.25,85.09 | R60.1 124.46,85.09 | 87.63,80.01 C11.2 87.63,75.56 R61.2
N$1
  Bottom 2.184: X4.1 128.27,92.71 138.43,82.55 138.43,68.58 142.24,64.77 142.24,53.34 143.51,52.07 151.13,52.07 152.4,53.34 152.4,57.12 K1.11B K1.11A
N$2
  Top 0.305: Q1.B 69.85,36.83 R18.1 71.12,40.64 66.04,45.72 R3.1
N$3
  Bottom 2.184: X4.3 138.43,92.71 143.51,87.63 151.13,87.63 152.4,86.36 152.4,82.55 152.37,82.55 K2.11A K2.11B
N$5
  Bottom 0.305: X5.18 85.09,10.79 86.36,12.06 R35.1
N$7
  Top 0.305: Q2.B 77.47,36.83 R17.1 78.74,40.64 73.66,45.72 R4.1
N$8
  Top 0.305: Q3.B 85.09,36.83 R15.1 86.36,40.64 81.28,45.72 R5.1
N$9
  Top 1.422: K3.24 95.32,65.97 93.98,67.31 93.98,72.39 90.17,76.2 P6.1
N$11
  Bottom 0.305: DCDC1.9 26.67,64.77 24.13,62.23 24.13,35.56 21.59,33.02 R42.1 R52.1
N$12
  Bottom 1.422: P4.1 100.33,73.63 K3.14
N$14  (via drill 0.8)
  Top 0.61: K2.A2 132.18,82.45 134.62,80.01 134.62,64.14 133.35,62.87 132.08,62.87 | v118.11,53.34 118.11,58.42 116.84,59.69 D4.A 118.75,62.87 125.73,62.87 | 125.73,62.87 132.08,62.87 | K3.A2 125.63,62.97 125.73,62.87 | K1.A2 132.18,62.97 132.08,62.87
  Bottom 0.61: v118.11,53.34 116.84,52.07 Q9.C
N$15
  Top 0.61: 101.6,54.61 96.52,54.61 91.44,59.69 82.55,59.69 80.64,61.59 80.64,73.03 82.55,74.93 C11.1 | IC2.3 101.6,54.61 | 101.6,54.61 111.76,54.61 114.3,52.07 114.3,48.26 118.11,44.45 118.11,34.29 119.38,33.02 IC1.3
  Top 1.422: R1.2 76.2,87.63 | 76.2,87.63 D7.C | R2.1 76.2,77.47 | 76.2,77.47 76.2,87.63 | C11.1 76.2,77.47
N$16
  Top 0.305: Q4.B 92.71,36.83 R16.1 93.98,40.64 88.9,45.72 R6.1
N$17
  Top 0.305: Q5.B 100.33,36.83 R13.1 101.6,40.64 96.52,45.72 R7.1
N$18
  Top 0.305: Q6.B 107.95,36.83 R14.1 109.22,40.64 104.14,45.72 R8.1
N$19
  Bottom 0.305: R11.1 106.68,20.32 Q7.B 106.68,17.78 R9.1
N$20
  Top 0.305: R11.2 119.38,22.86 119.38,26.04 118.11,27.3 118.11,29.84 118.75,30.48 IC1.2
N$21
  Bottom 0.305: R12.2 115.57,8.89 120.02,13.34 120.02,15.88 120.65,16.51 IC1.1
N$22  (via drill 0.6)
  Top 0.305: IC1.14 110.49,27.94 109.22,29.21 v109.22,35.56
  Bottom 0.305: v109.22,35.56 110.49,36.83 110.49,41.27 106.05,45.72 102.87,45.72 101.6,46.99 R13.2
N$23
  Top 0.305: R14.2 109.22,42.55 110.49,41.27 110.49,31.11 111.12,30.48 IC1.13
N$24
  Top 0.305: IC2.2 99.06,52.07 97.79,53.34 93.98,53.34 90.17,49.53 87.63,49.53 R15.2
N$25
  Bottom 0.305: IC2.1 R16.2
N$26
  Top 0.305: R20.2 66.04,33.02 67.31,34.29 Q1.C
  Bottom 0.305: R19.2 48.26,20.32 52.07,24.13 R20.2
N$27
  Bottom 0.305: IC2.14 96.52,54.61 91.44,49.53 91.44,46.99 90.17,45.72 80.01,45.72 78.74,46.99 R17.2
N$28
  Bottom 0.305: IC2.13 99.06,59.69 98.42,60.33 95.89,60.33 94.61,59.05 94.61,53.98 90.17,49.53 72.39,49.53 R18.2
N$29
  Bottom 0.305: LED1.A R19.1
N$30
  Bottom 0.305: X5.2 64.77,10.79 66.04,12.06 R20.1
N$31
  Top 0.305: Q2.C 73.66,34.29 68.58,29.21 R22.2
  Bottom 0.305: R21.2 43.18,20.95 47.62,25.4 67.31,25.4 R22.2
N$32
  Bottom 0.305: X5.4 67.31,10.79 68.58,12.06 R22.1
N$33
  Top 0.305: Q3.C 81.28,34.29 R24.2
  Bottom 0.305: R23.2 38.1,21.59 43.18,26.67 68.58,26.67 R24.2
N$34
  Bottom 0.305: X5.6 69.85,10.79 71.12,12.06 R24.1
N$35
  Top 0.305: Q4.C 89.53,34.29 85.72,30.48 80.01,30.48 R26.2
  Bottom 0.305: R25.2 33.02,22.23 38.73,27.94 69.85,27.94 R26.2
N$36
  Bottom 0.305: X5.8 72.39,10.79 73.66,12.06 R26.1
N$37
  Top 0.305: Q5.C 93.98,34.29 88.27,28.57 80.64,28.57 R28.2
  Bottom 0.305: R27.2 27.94,22.86 34.29,29.21 71.12,29.21 R28.2
N$38
  Bottom 0.305: X5.10 74.93,10.79 76.2,12.06 R28.1
N$39
  Top 0.305: Q6.C 104.78,34.29 102.87,32.38 93.34,32.38 87.63,26.67 81.28,26.67 R30.2
  Bottom 0.305: R29.2 22.86,15.88 24.13,14.61 48.9,14.61 51.44,17.14 51.44,19.68 53.98,22.23 76.83,22.23 R30.2
N$40
  Bottom 0.305: X5.12 77.47,10.79 78.74,12.06 R30.1
N$41
  Top 0.305: Q7.C 82.55,19.05 81.28,20.32 R32.2
  Bottom 0.305: R31.2 17.78,15.24 19.68,13.34 49.53,13.34 53.34,17.14 53.34,19.68 54.61,20.95 78.11,20.95 R32.2
N$42
  Bottom 0.305: X5.14 80.01,10.79 81.28,12.06 R32.1
N$43
  Bottom 0.305: R33.2 12.7,13.97 14.61,12.06 50.16,12.06 55.24,17.14 55.24,19.05 55.88,19.68 83.82,19.68 | Q8.C 105.41,12.06 105.41,14.61 100.33,19.68 83.82,19.68 | 83.82,19.68 R34.2
N$44
  Bottom 0.305: X5.16 82.55,10.79 83.82,12.06 R34.1
N$45
  Bottom 0.305: Q8.B 106.68,10.16 105.41,8.89 R12.1 108.58,6.99 111.76,10.16 111.76,12.06 113.03,13.34 R10.1
N$46
  Bottom 0.305: LED2.A R21.1
N$47
  Bottom 0.305: LED3.A R23.1
N$48
  Bottom 0.305: LED4.A R25.1
N$49
  Bottom 0.305: LED5.A R27.1
N$50
  Bottom 0.305: LED6.A R29.1
N$51
  Bottom 0.305: LED7.A R31.1
N$52
  Bottom 0.305: LED8.A R33.1
N$53  (via drill 0.5)
  Top 0.305: v114.3,26.04 93.34,26.04 R37.2
  Bottom 0.305: R49.1 117.47,55.88 119.38,53.98 Q9.B 119.38,45.72 115.57,41.91 111.76,41.91 111.12,41.27 111.12,37.47 111.76,36.83 115.57,36.83 116.84,35.56 116.84,28.57 v114.3,26.04
N$54
  Top 0.305: Q10.B 128.91,39.37 126.36,36.83 126.36,28.57 123.19,25.4 123.19,20.95 121.92,19.68 115.57,19.68 109.86,25.4 100.33,25.4 R50.1
  Bottom 0.305: R50.1 99.06,25.4 98.42,26.04 94.61,26.04 93.98,25.4 R38.2
N$55
  Bottom 0.305: X5.20 87.63,10.79 88.9,12.06 R36.1
N$56
  Top 0.305: Q11.B 126.36,26.67 124.46,24.77 124.46,20.32 122.56,18.41 115.57,18.41 112.08,14.92 107,14.92 105.41,16.51 105.41,22.86 104.14,24.13 R51.1
  Bottom 0.305: R51.1 101.6,22.86 100.97,22.23 97.16,22.23 96.52,22.86 R39.2
N$57
  Bottom 0.305: X5.22 90.17,10.79 91.44,12.06 R37.1
N$58
  Bottom 0.61: K5.S2 K5.S1 157.48,13.34 156.21,12.06 147.32,12.06 146.05,10.79 R43.2
N$59
  Bottom 0.305: X5.24 92.71,10.79 93.98,12.06 R38.1
N$60
  Bottom 0.61: K4.16 D5.A Q10.C
N$61
  Bottom 0.61: K4.S2 K4.S1 156.21,34.29 154.94,33.02 154.94,15.24 153.67,13.97 R44.2
N$62
  Bottom 0.305: X5.26 95.25,10.79 96.52,12.06 R39.1
N$63
  Bottom 0.61: Q11.C D6.A 134.62,27.94 138.43,27.94 K5.16
N$64
  Bottom 0.61: X5.23 92.71,5.08 93.98,3.81 118.11,3.81 119.38,5.08 119.38,8.89 123.19,12.7 R44.1
N$65
  Bottom 1.422: X1.1 68.58,93.98 67.31,92.71 D3.A
N$66
  Bottom 0.61: X5.19 87.63,2.54 88.9,1.27 121.92,1.27 123.19,2.54 R43.1
N$69
  Bottom 0.61: X5.25 96.52,5.08 116.84,5.08 118.11,6.35 118.11,10.16 121.28,13.34 121.28,14.61 122.56,15.88 140.34,15.88 144.78,20.32 144.78,33.02 146.05,34.29 K4.P1 K4.P2
N$70
  Bottom 0.61: X5.21 90.17,3.81 91.44,2.54 120.02,2.54 121.28,3.81 121.28,6.99 122.56,8.26 140.34,8.26 142.24,10.16 142.24,15.24 147.32,20.32 K5.P1 K5.P2
N$98
  Top 0.61: K2.14B 157.38,71.02 154.94,68.58 R46.1
  Bottom 2.184: X4.4 147.32,97.79 156.06,97.79 157.48,96.37 157.48,82.62 K2.14A K2.14B
N$99
  Top 0.61: R45.1 156.21,45.72 157.48,46.99 157.48,57.08 K1.14B
  Bottom 2.184: X4.2 133.35,92.71 142.24,83.82 142.24,71.12 143.51,69.85 156.21,69.85 157.48,68.58 157.48,64.84 K1.14A K1.14B
REF
  Top 0.305: D8.C 85.09,82.55 87,80.64 87,78.74 86.36,78.11 R2.2 84.45,73.66 81.92,71.12 81.92,62.23 83.19,60.96 102.87,60.96 104.14,59.69 | IC2.11 104.14,59.69 | 104.14,59.69 105.41,60.96 107.95,60.96 109.22,59.69 IC2.9 | IC2.5 106.68,52.07 107.95,53.34 110.49,53.34 111.76,52.07 IC2.7 111.76,45.09 111.12,44.45 111.12,40.64 | 111.12,40.64 111.12,36.83 IC1.11 | IC1.9 111.12,40.64
  Bottom 0.305: IC2.9 109.22,55.88 111.76,53.34 IC2.7 | IC1.9 115.57,40.64 118.11,43.18 IC1.7 122.56,43.18 123.19,42.55 123.19,38.73 122.56,38.1 IC1.5
SPARE  (via drill 0.6)
  Top 0.305: IC1.6 121.92,40.64 123.19,39.37 v123.19,34.29 | v114.3,19.05 109.22,24.13 R41.2
  Bottom 0.305: v123.19,34.29 123.19,29.84 122.56,29.21 119.38,29.21 118.11,27.94 118.11,26.04 119.38,24.77 119.38,23.5 118.75,22.86 116.99,22.86 114.3,20.17 v114.3,19.05 | R41.2 105.41,24.13 102.87,21.59 90.17,21.59 88.9,22.86 R36.2

### Text on the board
Top: Design:JSIF | 01-2012 | SUPPLY | BOARD
tNames: 1 | 1 | 1 | 1 | Pin compatible with | XP Power JCP4024S12 | Design:JSIF | 01-2012 | SUPPLY | BOARD | 2 | 26 | 1 | 25